# EAGLE design ESPDRONE333 (1) (EAGLE 7.2.0)
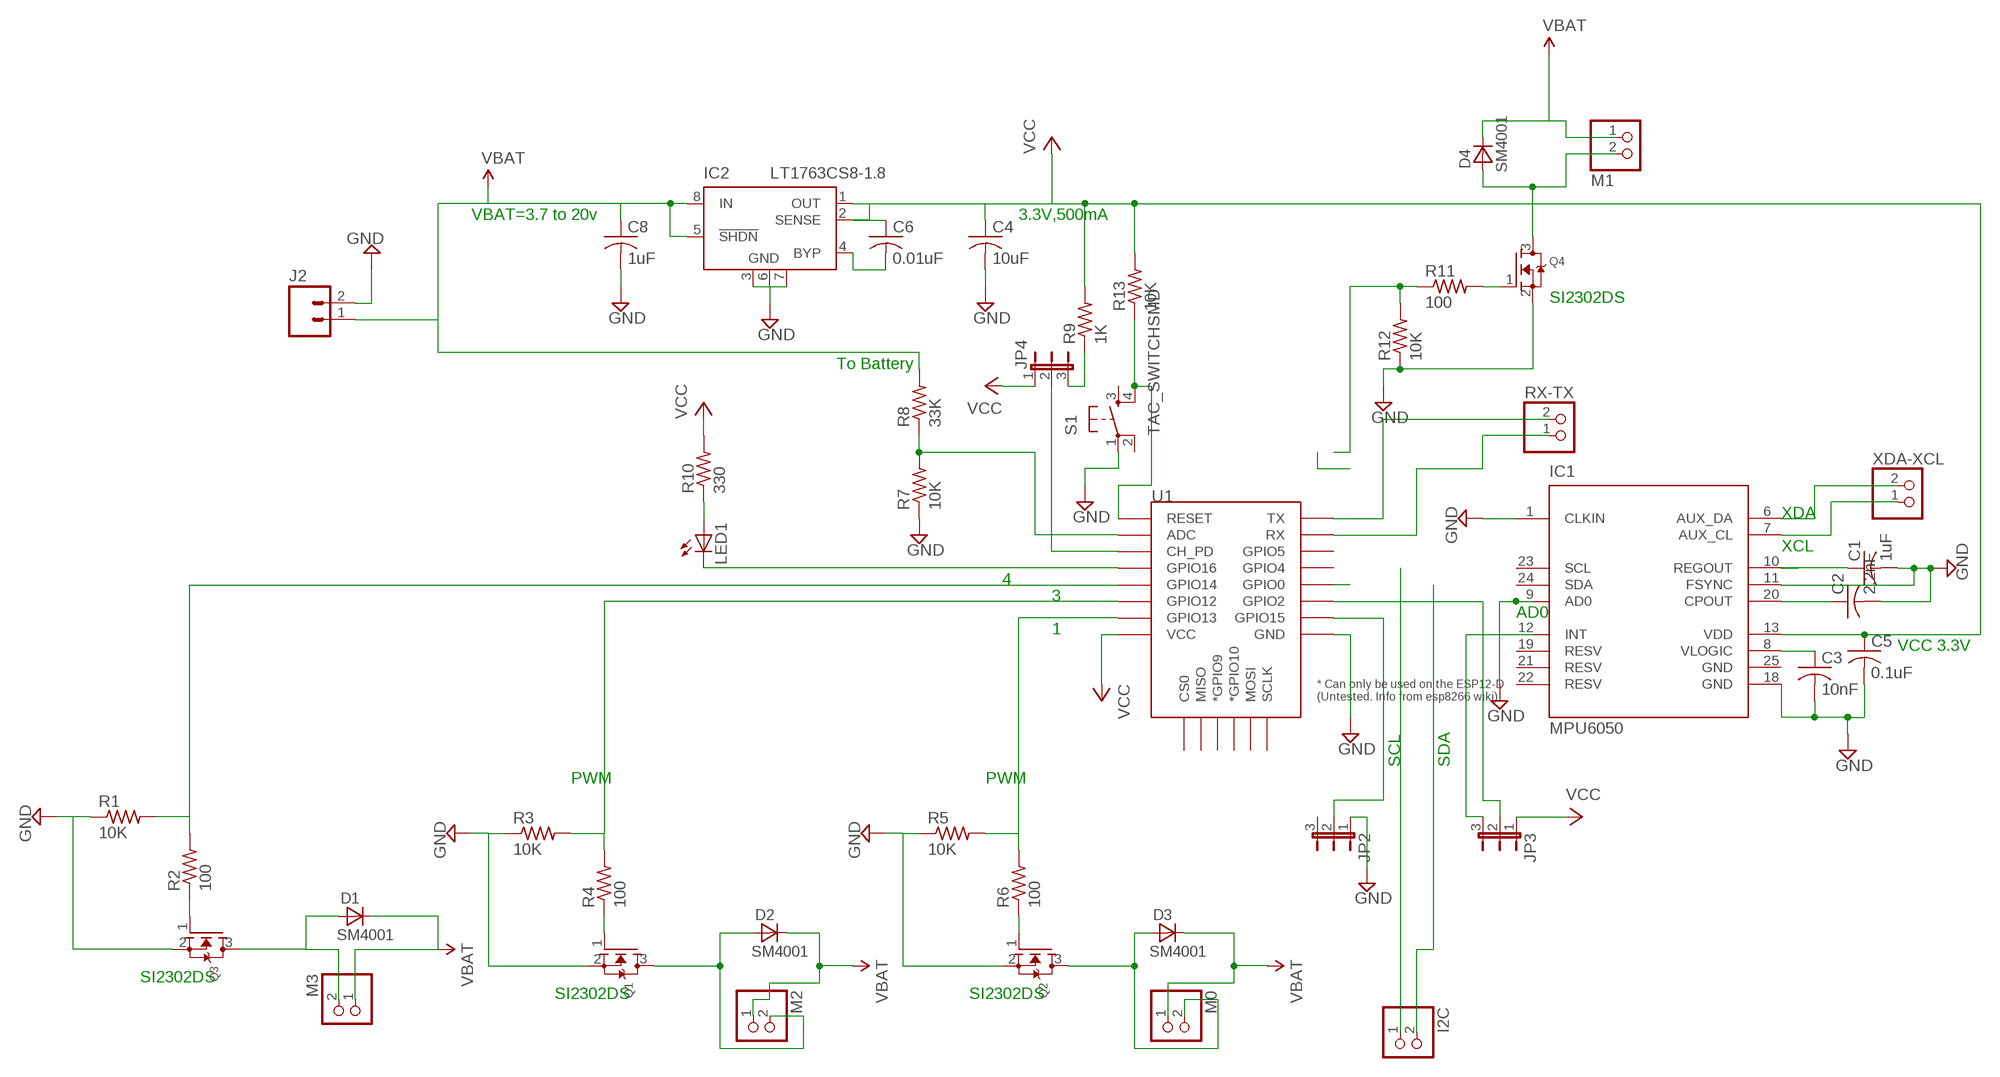
[diagram p0: schematic, sheet 1]

## Parts
C1  1uF  C-USC1206K  [C1206K]
C2  2.2nF  C-USC0603  [C0603]
C3  10nF  C-USC0603  [C0603]
C4  10uF  C-USC1608  [C1608]
C5  0.1uF  C-USC0603  [C0603]
C6  0.01uF  C-USC0603  [C0603]
C8  1uF  C-USC1608  [C1608]
D1  SM4001  SM400GENERIC  [MELF-MLL41]
D2  SM4001  SM400GENERIC  [MELF-MLL41]
D3  SM4001  SM400GENERIC  [MELF-MLL41]
D4  SM4001  SM400GENERIC  [MELF-MLL41]
I2C  JST_2PIN-SMT  [JST-PH-2-SMT]
IC1  MPU6050  [QFN50P400X400X95-25T265X275N]
IC2  LT1763CS8-1.8  [SOIC8]
J2  M02JST-PTH-2  [JST-2-PTH]
JP2  JP2E  [JP2]
JP3  JP2E  [JP2]
JP4  JP2E  [JP2]
LED1  LED  [SMARTLED-TTW]
M0  JST_2PIN-SMT  [JST-PH-2-SMT]
M1  JST_2PIN-SMT  [JST-PH-2-SMT]
M2  JST_2PIN-SMT  [JST-PH-2-SMT]
M3  JST_2PIN-SMT  [JST-PH-2-SMT]
Q1  MOSFET-NREFLOW  [SOT23]
Q2  MOSFET-NREFLOW  [SOT23]
Q3  MOSFET-NREFLOW  [SOT23]
Q4  MOSFET-NREFLOW  [SOT23]
R1  10K  R-US_R0603  [R0603]
R2  100  R-US_R0603  [R0603]
R3  10K  R-US_R0603  [R0603]
R4  100  R-US_R0603  [R0603]
R5  10K  R-US_R0603  [R0603]
R6  100  R-US_R0603  [R0603]
R7  10K  R-US_R0603  [R0603]
R8  33K  R-US_R0603  [R0603]
R9  1K  R-US_R0603  [R0603]
R10  330  R-US_R0603  [R0603]
R11  100  R-US_R0603  [R0603]
R12  10K  R-US_R0603  [R0603]
R13  10K  R-US_R0603  [R0603]
RX-TX  JST_2PIN-SMT  [JST-PH-2-SMT]
S1  TAC_SWITCHSMD  [TACTILE-SWITCH-SMD]
U1  ESP12ESMD  [ESP12E-SMD]
XDA-XCL  JST_2PIN-SMT  [JST-PH-2-SMT]

## Nets
GND: C1.2 C2.2 C3.2 C4.2 C5.2 C8.2 IC1.1(CLKIN) IC1.9(AD0) IC1.11(FSYNC) IC1.18(GND) IC2.3(GND) IC2.7(GND) J2.2 JP2.1 Q1.2(S) Q2.2(S) Q3.2(S) Q4.2(S) R1.1 R3.1 R5.1 R7.1 R12.1 S1.1 U1.GND
I2C: I2C.2
N$1: I2C.1
N$2: R13.1 S1.4 U1.RESET
N$3: R11.1 R12.2
N$4: C1.1 IC1.10(REGOUT)
N$6: IC1.7(AUX_CL) XDA-XCL.1
N$7: C2.1 IC1.20(CPOUT)
N$8: JP3.2 U1.GPIO2
N$9: C3.1 IC1.8(VLOGIC)
N$10: Q3.1(G) R2.1
N$11: D1.A M3.2 Q3.3(D)
N$12: R1.2 R2.2 U1.GPIO14
N$13: R7.2 R8.1 U1.ADC
N$14: Q4.1(G) R11.2
N$15: D2.A M2.2 Q1.3(D)
N$16: R3.2 R4.2 U1.GPIO12
N$17: RX-TX.1 U1.RXD0(RX)
N$18: JP3.3
N$19: Q1.1(G) R4.1
N$20: Q2.1(G) R6.1
N$21: LED1.A@1(A) R10.1
N$22: JP4.3 R9.1
N$23: R5.2 R6.2 U1.GPIO13
N$24: D3.A M0.2 Q2.3(D)
N$25: U1.GPIO0
N$26: JP2.2 U1.GPIO15
N$29: D4.A M1.2 Q4.3(D)
N$31: JP4.2 U1.CH_PD
N$32: LED1.C@1(C) U1.GPIO16
N$35: C6.2 IC2.4(BYP)
VCC: C4.1 C5.1 C6.1 C8.1 D1.C D2.C D3.C D4.C IC1.13(VDD) IC2.1(OUT) IC2.2(SENSE) IC2.5(!SHDN) IC2.8(IN) J2.1 JP3.1 JP4.1 M0.1 M1.1 M2.1 M3.1 R8.2 R9.2 R10.2 R13.2 U1.VCC ; supply symbol labelled VBAT
VCC1: RX-TX.2 U1.TXD0(TX)
VCC2: IC1.6(AUX_DA) XDA-XCL.2
Unconnected: IC1.2(NC) IC1.3(NC) IC1.4(NC) IC1.5(NC) IC1.12(INT) IC1.14(NC) IC1.15(NC) IC1.16(NC) IC1.17(NC) IC1.19(RESV) IC1.21(RESV) IC1.22(RESV) IC1.23(SCL) IC1.24(SDA) JP2.3 S1.2 S1.3 U1.CS0 U1.GPIO4 U1.GPIO5 U1.GPIO9(*GPIO9) U1.GPIO10(*GPIO10) U1.MISO U1.MOSI U1.SCLK

## Notes on the sheet
- VBAT=3.7 to 20v | 3.3V,500mA
- SI2302DS
- To Battery
- XDA
- XCL
- 4
- 3
- AD0
- 1
- VCC 3.3V
- SCL | SDA
- PWM | PWM
- SI2302DS
- SI2302DS | SI2302DS

## Power pins joined to a net without a drawn wire
GND: IC1.25(GND) IC2.6(GND)

## Library data of the parts
C1-C6 C8 = adafruit:C-US: CAPACITOR, American symbol
D1-D4 = _mod_diode:SM400*: SM4001 .. SM4007 General Purpose Rectifier, 1 A SMD-Version of 1N4001 .. 1N4007 Case: MELF-MLL41 = DO 213 AB Author: Dipl.-Ing. FH Rainer Bayer HHN Hochschule Heilbronn, rainer.bayer@hs-heilbronn.de Ingenieurbüro ing-rb, mail@ing-rb.de
I2C M0 M1-M3 RX-TX XDA-XCL = adafruit:JST_2PIN: JST 2-Pin Connectors of various flavors SMT-RA (S2B-PH-SM4) 4UConnector #17311 SMT (B2B-PH-SM4) THM-RA (S2B-PH) THM (B2B-PH)
IC1 = invensense:MPU6050: The triple-axis MEMS gyroscope
IC2 = linear-technology:LT1763CS8: 500mA, Low Noise, LDO Micropower Regulators Source: http://cds.linear.com/docs/Datasheet/1763ff.pdf; MPN: LT1763CS8-1.8; OC_FARNELL: 1273615; OC_NEWARK: 57M6047
J2 = SparkFun-Connectors:M02: Standard 2-pin 0.1" header. Use with - straight break away headers ( PRT-00116) - right angle break away headers (PRT-00553) - swiss pins (PRT-00743) - machine pins (PRT-00117) - female headers (PRT-00115) Molex polarized connector foot print use with: PRT-08233 with associated crimp pins and housings. 2.54_SCREWTERM for use with PRT-10571. 3.5mm Screw Terminal footprints for PRT-08084 5mm Screw Terminal footprints for use with PRT-08432; PROD_ID: CONN-09863; SKU: PRT-09914
JP2-JP4 = jumper:JP2E: JUMPER
LED1 = adafruit:LED: LED OSRAM: - CHIPLED LG R971, LG N971, LY N971, LG Q971, LY Q971, LO R971, LY R971 LH N974, LH R974 LS Q976, LO Q976, LY Q976 LO Q996 - Hyper CHIPLED LW Q18S LB Q993, LB Q99A, LB R99A - SideLED LS A670, LO A670, LY A670, LG A670, LP A670 LB A673, LV A673, LT A673, LW A673 LH A674 LY A675 LS A676, LA A676, LO A676, LY A676, LW A676 LS A679, LY A679, LG A679 - Hyper Micro SIDELED® LS Y876, LA Y876, LO Y876, LY Y876 LT Y87S - SmartLED LW L88C, LW L88S LB L89C, LB L89S, LG L890 LS L89K, LO L89K, LY L89K LS L896, LA L896, LO L896, LY L896 - TOPLED LS T670, LO T670, LY T670, LG T670, LP T670 LSG T670, LSP T670, LSY T670, LOP T670, LYG T670 LG T671, LOG T671, LSG T671 LB T673, LV T673, LT T673, LW T673 LH T674 LS T676, LA T676, LO T676, LY T676, LB T676, LH T676, LSB T676, LW T676 LB T67C, LV T67C, LT T67C, LS T67K, LO T67K, LY T67K, LW E67C LS E67B, LA E67B, LO E67B, LY E67B, LB E67C, LV E67C, LT E67C LW T67C LS T679, LY T679, LG T679 LS T770, LO T770, LY T770, LG T770, LP T770 LB T773, LV T773, LT T773, LW T773 LH T774 LS E675, LA E675, LY E675, LS T675 LS T776, LA T776, LO T776, LY T776, LB T776 LHGB T686 LT T68C, LB T68C - Hyper Mini TOPLED® LB M676 - Mini TOPLED Santana® LG M470 LS M47K, LO M47K, LY M47K Source: http://www.osram.convergy.de/
Q1-Q4 = adafruit:MOSFET-N: N-Channel Mosfet 2N7002E - 60V 260mA SOT23 [Digikey: 2N7002ET1GOSTR-ND] - REEL BSH103 - 30V 850mA SOT23 [Digikey: 568-5013-1-ND]
R1-R13 = adafruit:R-US_: RESISTOR, American symbol
S1 = SparkFun-Retired:TAC_SWITCH: Momentary Switch Button commonly used for reset or general input. Spark Fun Electronics SKU : COM-00097 SMT- SWCH-08247; PROD_ID: SWCH-08247
U1 = esp8266modules:ESP12E: ESP12E Module

## Board
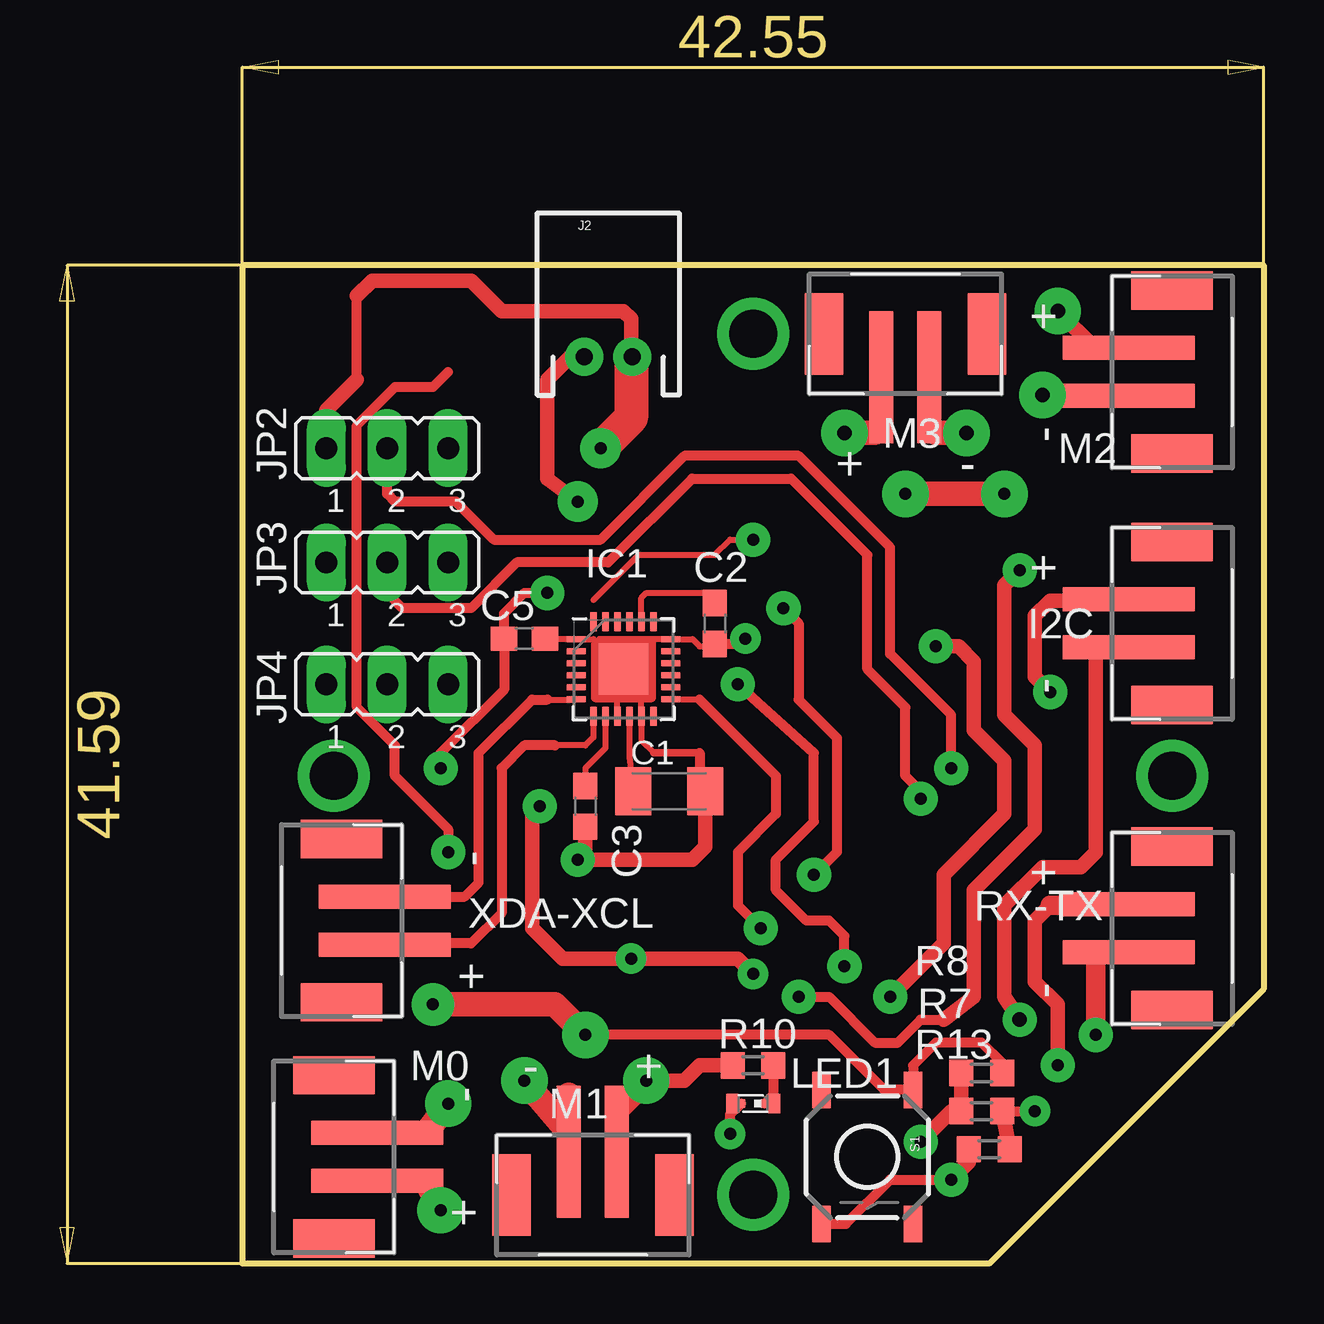
[diagram p1: board, top side]
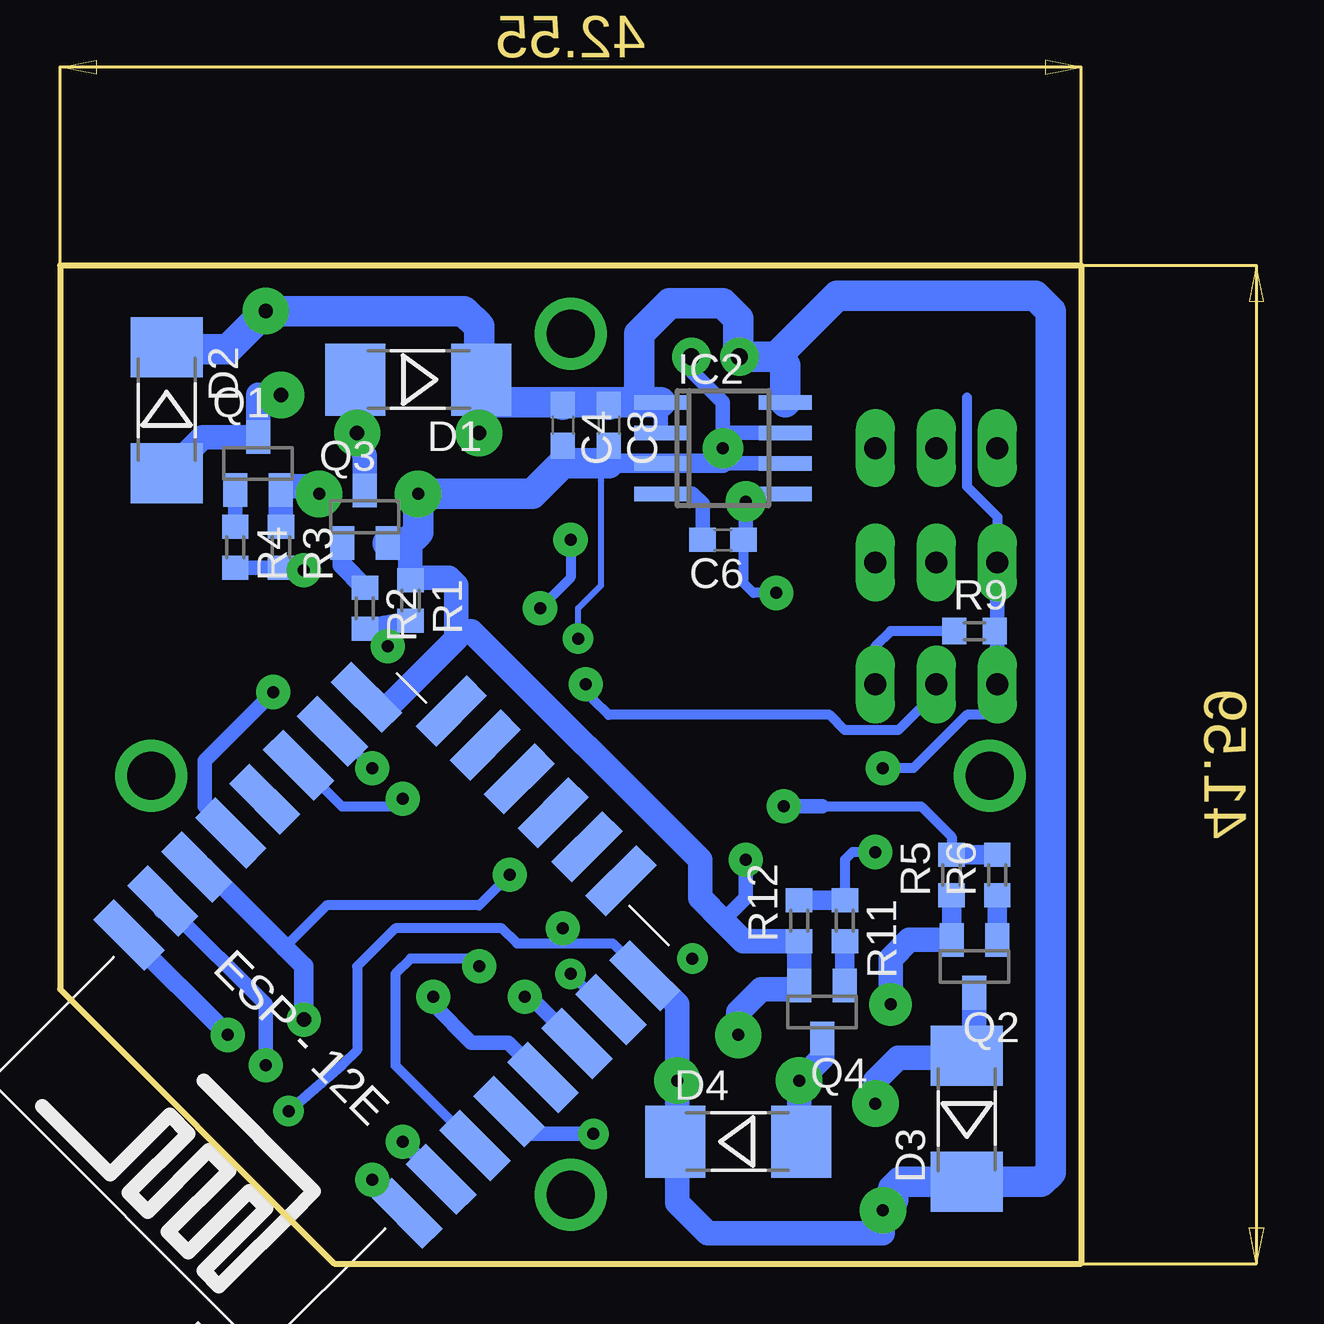
[diagram p2: board, bottom side, seen from below]

Size 42.55 x 41.59 mm. Coordinates in mm from the lower left corner, seen from the top.
Outline: 42.55,41.59 0,41.59 0,0 31.11,0 42.55,11.43 42.55,41.59
Copper layers (1*16): Top 0.035mm / dielectric 1.5mm / Bottom 0.035mm
Design rules "default *": minimum track width 10mil, minimum drill 24mil, track to track 8mil, track to pad 8mil, pad to pad 8mil, via to via 8mil, smd to smd 8mil, copper to edge 40mil, drill to drill 8mil, minimum pad ring 14mil, minimum via ring 14mil, stop-mask expansion 4mil, vias tented up to drill 0mil, thermal gap 10mil

### Footprints (pad centres in the part's own frame; a part is rotated, then mirrored left to right if it is on the bottom)
C1206K = smd 1.5 x 2: 1 -1.5,0; 2 1.5,0
C0603 = smd 1.1 x 1: 1 -0.85,0; 2 0.85,0
C1608 = smd 1.1 x 1: 1 -0.85,0; 2 0.85,0
MELF-MLL41 = smd 2.5 x 3: A 2.625,0; C -2.625,0
JST-PH-2-SMT = smd 1 x 5.5: 1 -1,-1.8; 2 1,-1.8 | smd 1.6 x 3.4: NC1 -3.4,0; NC2 3.4,0
QFN50P400X400X95-25T265X275N = smd 0.26 x 0.79: 1 -1.25,-1.97; 2 -0.75,-1.97; 3 -0.25,-1.97; 4 0.25,-1.97; 5 0.75,-1.97; 6 1.25,-1.97; 13 1.25,1.97; 14 0.75,1.97; 15 0.25,1.97; 16 -0.25,1.97; 17 -0.75,1.97; 18 -1.25,1.97 | smd 0.79 x 0.26: 7 1.97,-1.25; 8 1.97,-0.75; 9 1.97,-0.25; 10 1.97,0.25; 11 1.97,0.75; 12 1.97,1.25; 19 -1.97,1.25; 20 -1.97,0.75; 21 -1.97,0.25; 22 -1.97,-0.25; 23 -1.97,-0.75; 24 -1.97,-1.25 | smd 2.15 x 2.05: 25 0,0
SOIC8 = smd 0.6 x 2.2: 1 -1.905,-2.6; 2 -0.635,-2.6; 3 0.635,-2.6; 4 1.905,-2.6; 5 1.905,2.6; 6 0.635,2.6; 7 -0.635,2.6; 8 -1.905,2.6
JST-2-PTH = drill 0.7 pad 1.6: 1 -1,0; 2 1,0
JP2 = drill 0.914 long: 1 -2.54,0; 2 0,0; 3 2.54,0
SMARTLED-TTW = smd 0.8 x 0.5: A 0,-0.875; C 0,0.875 | smd 0.35 x 0.35: A@1 0,-0.5; C@1 0,0.5
SOT23 = smd 1 x 1.4: 1 -0.95,-1.1; 2 0.95,-1.1; 3 0,1.1
R0603 = smd 1 x 1.1: 1 -0.85,0; 2 0.85,0
TACTILE-SWITCH-SMD = smd 1.524 x 0.762: 1 -2.794,1.905; 2 2.794,1.905; 3 -2.794,-1.905; 4 2.794,-1.905
ESP12E-SMD = smd 3 x 1.2: ADC -8.3,3.8; CH_PD -8.3,1.8; GND 8.1,-8.2; GPIO0 8.1,-2.2; GPIO2 8.1,-4.2; GPIO4 8.1,-0.2; GPIO5 8.1,1.8; GPIO12 -8.3,-4.2; GPIO13 -8.3,-6.2; GPIO14 -8.3,-2.2; GPIO15 8.1,-6.2; GPIO16 -8.3,-0.2; RESET -8.3,5.8; RXD0 8.1,3.8; TXD0 8.1,5.8; VCC -8.3,-8.2 | smd 1.2 x 3: CS0 -4.8,-10.3; GPIO9 -0.8,-10.3; GPIO10 1.2,-10.3; MISO -2.8,-10.3; MOSI 3.2,-10.3; SCLK 5.2,-10.3

### Placement (x,y rotation side)
C1  17.78,19.68 0 top
C2  19.68,26.67 270 top
C3  14.29,19.05 270 top
C4  21.59,34.92 270 bottom
C5  11.75,26.04 0 top
C6  14.92,30.16 180 bottom
C8  19.68,34.92 270 bottom
D1  27.62,36.83 180 bottom
D2  38.1,35.56 270 bottom
D3  4.76,6.03 90 bottom
D4  14.29,5.08 0 bottom
I2C  38.73,26.67 270 top
IC1  15.88,24.77 270 top
IC2  14.92,33.97 270 bottom
J2  15.24,37.78 0 top
JP2  6.03,33.97 0 top
JP3  6.03,29.21 0 top
JP4  6.03,24.13 0 top
LED1  21.27,6.67 90 top
M0  3.81,4.45 90 top
M1  14.61,2.86 180 top
M2  38.73,37.15 270 top
M3  27.62,38.73 0 top
Q1  34.29,33.34 0 bottom
Q2  4.45,12.38 180 bottom
Q3  29.84,31.11 0 bottom
Q4  10.79,10.48 180 bottom
R1  27.94,27.62 270 bottom
R2  29.84,27.3 270 bottom
R3  33.34,29.84 270 bottom
R4  35.24,29.84 270 bottom
R5  5.4,16.19 90 bottom
R6  3.49,16.19 90 bottom
R7  30.8,7.94 180 top
R8  30.8,6.35 0 top
R9  4.45,26.35 0 bottom
R10  21.27,8.26 180 top
R11  9.84,14.29 270 bottom
R12  11.75,14.29 90 bottom
R13  31.11,4.76 0 top
RX-TX  38.73,13.97 270 top
S1  26.04,4.45 270 top
U1  29.84,12.06 135 bottom
XDA-XCL  4.13,14.29 90 top

### Tracks (layer width: path | path; a pad name or v marks a point on that pad's centre or on a via)
GND  (via drill 0.5 pad 1.27, 0.5 pad 1.42, 0.5 pad 1.68, 0.5 pad 1.78, 0.5 pad 1.93)
  Top 0.254: C5.2 12.78,26.02 IC1.1 14.62,26.02 IC1.25 | 17.14,21.27 16.62,21.79 IC1.11 16.62,24.02 IC1.25 | C1.2 19.28,20.09 | IC1.25 17.12,26.02 IC1.18 18.75,26.02 19.05,25.72 19.37,25.72 19.58,26.04 C2.2 | IC1.9 15.62,24.52 IC1.25
  Top 0.305: 17.14,21.27 19.05,21.27 19.05,19.91 C1.2 | C2.2 20.22,25.82
  Top 0.406: R7.1 31.65,8.36 30.8,9.21 28.89,9.21 27.94,8.26 S1.1 26.73,7.24 24.45,9.53 v14.29,9.53 | 4.76,36.83 4.76,40.32 | 19.05,21.27 19.05,20 19.37,19.68 | 20.22,25.82 20.42,25.82 v20.95,26.04
  Top 0.61: JP2.1 3.49,35.56 4.76,36.83 | J2.2 16.19,37.83 16.19,39.37 15.88,39.69 10.79,39.69 9.53,40.96 5.4,40.96 4.76,40.32 | C3.2 14.29,17.14 v13.97,16.83 18.73,16.83 19.28,17.38 C1.2
  Top 1.016: v31.75,32.07 v27.62,32.07 | v7.94,10.79 13.02,10.79 v14.29,9.53
  Top 1.422: 16.19,37.73 16.19,35.24 v14.92,33.97
  Bottom 0.254: v20.95,26.04 20.95,27.3 20,28.26 20,33.34
  Bottom 0.61: IC2.7 14.92,34.61 | 14.92,34.61 v14.92,33.97 14.92,33.34 IC2.6 | 14.92,34.61 14.92,35.88 16.19,37.15 16.19,37.73 J2.2 | C4.2 21.59,33.34 | C8.2 19.68,33.34 | R3.1 Q1.2 | v13.97,16.83 13.97,15.24 14.92,14.29
  Bottom 0.813: R1.1 | 14.92,33.34 IC2.3 19.68,33.34 | R5.1 Q2.2 | 11.99,11.33 11.89,11.43 Q4.2
  Bottom 1.016: R3.1 33.34,32.38 32.07,32.38 v31.75,32.07 | U1.GND 29.62,23.59 29.21,23.18 28.89,23.18 26.04,26.04 26.04,26.35 | 26.04,26.35 26.04,28.26 26.35,28.57 27.84,28.57 R1.1 | R1.1 27.94,29.7 28.26,30.02 | Q2.2 7.15,13.48 7.94,12.7 v7.94,10.79 | Q4.2 R12.1 14.07,13.44 14.92,14.29 15.88,15.24 15.88,16.83 25.4,26.35 26.04,26.35 | 11.89,11.43 13.34,11.43 14.29,10.48 v14.29,9.53
  Bottom 1.27: 19.68,33.34 20,33.34 21.59,33.34 22.86,32.07 v27.62,32.07 27.62,30.48 28.09,30.02 28.26,30.02 Q3.2
I2C  (via drill 0.5 pad 1.42, 0.6 pad 1.42)
  Top 0.254: 14.62,27.64 16.51,29.53 19.68,29.53 20.32,30.16 v21.27,30.16
  Top 0.406: v22.54,27.3 23.18,26.67 23.18,23.5 24.77,21.91 24.77,17.14 v23.81,16.19
  Top 0.61: 36.98,25.72 35.24,25.72 35.56,25.4 35.56,17.14 34.92,16.51 33.34,16.51 31.75,14.92 31.75,11.11 v32.38,10.16 | 37.47,25.72 36.98,25.72 | 36.98,25.72 I2C.2
  Bottom 0.406: v21.27,30.16 21.27,28.57 v22.54,27.3 | v23.81,16.19 25.08,14.92 31.43,14.92 33.18,13.18
  Bottom 0.813: 36.52,16.52 33.18,13.18 32.38,12.38 v32.38,10.16
N$1  (via drill 0.5 pad 1.42)
  Top 0.61: v33.66,23.81 33.02,24.45 33.02,26.99 33.66,27.62 36.89,27.62 I2C.1
  Bottom 0.61: 35.4,17.93 36.51,19.05 36.51,20.95 v33.66,23.81
N$2  (via drill 0.5 pad 1.42)
  Top 0.406: S1.4 25.15,1.65 26.99,3.49 v29.53,3.49
  Top 0.61: R13.1 30.27,4.23 v29.53,3.49
  Bottom 0.61: U1.RESET 28.13,2.1 v29.53,3.49
N$3  (via drill 0.5 pad 1.42)
  Top 0.406: 8.57,37.15 7.94,36.51 6.35,36.51 4.76,34.92 4.76,23.18 6.35,21.59 6.35,20.32 8.57,18.1 v8.57,17.14
  Bottom 0.406: v8.57,17.14 9.53,17.14 9.84,16.83 R11.1
  Bottom 0.813: R11.1 R12.2
N$4
  Top 0.254: IC1.10 16.12,21.11 C1.1
N$6
  Top 0.254: IC1.7 14.62,21.93 14.29,21.59 13.02,21.59
  Top 0.406: 13.02,21.59 11.75,21.59 10.79,20.64 10.79,14.61 9.53,13.34 5.97,13.34 XDA-XCL.1
N$7
  Top 0.254: IC1.20 16.62,27.74 16.83,27.94 19.37,27.94 19.68,27.62 C2.1
N$8  (via drill 0.5 pad 1.42)
  Top 0.406: v28.26,19.37 28.26,19.68 27.62,20.32 27.62,23.18 26.04,24.77 26.04,29.53 22.86,32.7 18.73,32.7 15.24,29.21 11.43,29.21 9.53,27.3 6.67,27.3 6.03,27.94 JP3.2
  Bottom 0.406: U1.GPIO2 32.51,20.76 30.8,19.05 28.57,19.05 v28.26,19.37
N$9
  Top 0.254: IC1.8 15.12,21.48 14.29,20.64 C3.1
N$10
  Bottom 0.813: Q3.1 30.8,29.11 R2.1
N$11  (via drill 0.6 pad 1.93)
  Top 1.016: M3.2 28.62,34.88 28.89,34.61 v30.16,34.61
  Bottom 1.016: Q3.3 29.84,33.66 30.16,34.29 v30.16,34.61 30.16,36.74 D1.A
  Bottom 1.27: 30.48,36.91 D1.A
N$12  (via drill 0.5 pad 1.42)
  Top 0.61: v28.89,25.72 29.84,25.72 30.48,25.08 30.48,22.23 31.75,20.95 31.75,18.73 29.21,16.19 29.21,13.34 v26.99,11.11
  Bottom 0.61: 22.74,7.82 22.42,7.82 U1.GPIO14 23.88,9.21 25.4,9.21 26.99,10.79 v26.99,11.11 | v28.89,25.72 28.89,26.5 28.99,26.6
  Bottom 0.813: R1.2 28.99,26.6 R2.2
N$13  (via drill 0.5 pad 1.42)
  Top 0.61: 28.57,5.08 v28.26,5.08 29.53,6.35 R8.1 R7.2
  Bottom 0.61: U1.ADC 26.69,3.51 v28.26,5.08
N$14
  Bottom 0.813: R11.2 Q4.1
N$15  (via drill 0.6 pad 1.93)
  Top 1.016: M2.2 33.38,36.15 v33.34,36.2
  Bottom 1.016: D2.A 36.6,34.44 Q1.3 34.29,36.2 v33.34,36.2
N$16  (via drill 0.5 pad 1.42)
  Top 0.406: v23.18,11.11 24.45,11.11 26.35,9.21 27.3,9.21 28.26,10.16 29.21,10.16
  Top 0.61: v32.38,28.89 31.75,28.26 31.75,22.86 33.02,21.59 33.02,18.1 30.48,15.56 30.48,11.11 29.21,10.16
  Bottom 0.61: R4.2 R3.2 32.49,29 v32.38,28.89 | 21.23,9.17 U1.GPIO12 22.95,11.11 v23.18,11.11
N$17  (via drill 0.5 pad 1.42)
  Top 0.61: 33.66,14.92 33.02,14.29 33.02,11.75 33.97,10.79 v33.97,8.26
  Top 0.813: 33.66,14.92 36.89,14.92 RX-TX.1
  Bottom 0.61: 37.94,14.77 33.97,10.79 v33.97,8.26
  Bottom 0.813: U1.RXD0 38.26,14.77 37.94,14.77
N$19
  Bottom 0.61: R4.1 Q1.1
N$20
  Bottom 0.813: R6.1 Q2.1
N$21
  Top 0.406: R10.1 22.12,7.02 LED1.A@1
N$22
  Bottom 0.406: R9.1 7.94,26.35 8.57,25.72 JP4.3
N$23  (via drill 0.5 pad 1.27, 0.5 pad 1.42)
  Top 0.61: v21.27,12.06 20.64,12.7 v16.19,12.7 13.34,12.7 12.06,13.97 12.06,18.73 v12.38,19.05
  Bottom 0.406: U1.GPIO13 19.79,10.58 v21.27,12.06 | 5.5,17.14 R5.2 5.4,17.78 6.67,19.05 10.79,19.05
  Bottom 0.61: v12.38,19.05 10.79,19.05
  Bottom 0.813: R6.2 R5.2
N$24  (via drill 0.5 pad 1.93)
  Top 1.016: M0.2 7.67,5.45 v8.57,6.67
  Bottom 1.016: v8.57,6.67 8.57,7.62 7.62,8.57 4.85,8.57 D3.A 4.45,8.97 Q2.3
N$26  (via drill 0.5 pad 1.42)
  Top 0.406: v29.53,20.64 29.53,22.86 26.99,25.4 26.99,29.84 23.18,33.66 18.41,33.66 14.92,30.16 10.48,30.16 8.89,31.75 6.35,31.75 6.03,32.07 JP2.2
  Bottom 0.406: U1.GPIO15 31.07,22.18 v29.53,20.64
N$29  (via drill 0.5 pad 1.93)
  Top 1.016: 13.61,5.45 13.61,7.03 | M1.2 13.61,5.45 | 13.61,5.45 v11.75,7.62
  Bottom 1.016: D4.A 11.75,5.17 v11.75,7.62 10.79,8.57 Q4.3
N$31  (via drill 0.5 pad 1.42)
  Top 0.406: v20.64,24.13 23.81,21.27 23.81,18.41 22.23,16.83 22.23,15.56 23.5,14.29 24.45,14.29 25.08,13.65 v25.08,12.38
  Bottom 0.406: U1.CH_PD 25.56,4.92 25.56,5.24 28.57,8.26 28.57,12.06 27.94,12.7 25.4,12.7 v25.08,12.38 | JP4.2 6.03,23.81 7.62,22.23 9.84,22.23 10.48,22.86 19.68,22.86 20.32,23.5 v20.64,24.13
N$32  (via drill 0.5 pad 1.27)
  Top 0.406: v20.32,5.4 20.32,6.21 LED1.C@1
  Bottom 0.61: U1.GPIO16 23.8,6.34 22.86,5.4 v20.32,5.4
N$33  (via drill 2)
  other vias: 21.27,2.86
N$34  (via drill 2)
  other vias: 3.81,20.32
N$35
  Bottom 0.61: C6.2 15.77,31.65 16.19,32.07 IC2.4
N$36  (via drill 2)
  other vias: 21.27,38.73
N$37  (via drill 2)
  other vias: 38.73,20.32
VCC  (via drill 0.5 pad 1.27, 0.5 pad 1.42, 0.5 pad 1.68, 0.5 pad 1.93, 0.6 pad 1.93)
  Top 0.254: IC1.13 19.03,23.52 19.05,23.5
  Top 0.406: R8.2 v33.02,6.35 | v12.7,27.94 11.75,27.94 10.9,27.09 C5.1 10.9,23.91 8.26,21.27 v8.26,20.64 | 19.05,23.5 22.23,20.32 22.23,18.73 20.64,17.14 20.64,14.92 v21.59,13.97
  Top 0.61: 14.29,37.73 J2.1 13.65,37.78 12.7,36.83 12.7,32.7 v13.97,31.75 | M2.1 35.51,38.15 v33.97,39.69 | R13.2 R8.2 | v16.83,7.62 18.41,7.62 19.05,8.26 R10.2
  Top 1.016: M3.1 26.62,34.88 26.35,34.61 v25.08,34.61 | M1.1 15.61,6.4 v16.83,7.62 | M0.1 7.67,3.44 v8.26,2.22
  Bottom 0.406: 4.76,36.09 4.76,32.38 3.49,31.11 JP3.1 | R9.2 3.49,26.25 JP4.1 3.49,23.18 3.81,22.86 4.76,22.86 6.99,20.64 v8.26,20.64 | v33.02,6.35 30.8,8.26 30.16,8.89 30.16,12.38 28.57,13.97 24.13,13.97 23.5,13.34 21.27,13.34 | 21.27,13.34 19.52,13.34 U1.VCC | v12.7,27.94 13.65,27.94 14.07,28.36 C6.1 | v21.59,13.97 21.27,13.34
  Bottom 0.61: C6.1 13.97,30.27 v13.97,31.75 13.97,32.07 IC2.5 | 19.58,35.88 C8.1 | IC2.2 IC2.1 | JP4.1 JP3.1
  Bottom 1.016: v25.08,34.61 25.08,35.88 | U1.VCC 18.03,11.99 16.83,10.79 v16.83,7.62 16.83,4.21 | 16.83,4.21 D4.C | 16.83,4.21 16.83,2.54 15.56,1.27 8.26,1.27 v8.26,2.22
  Bottom 1.27: IC2.8 12.32,37.41 12.7,37.78 | 12.7,37.78 J2.1 14.29,37.83 14.29,39.37 14.92,40.01 17.14,40.01 18.41,38.73 18.41,35.88 | IC2.1 18.41,35.88 | 25.08,37.38 25.08,35.88 21.59,35.88 | 25.08,37.38 D1.C | 18.41,35.88 19.68,35.88 | 19.68,35.88 21.59,35.88 | C8.1 19.68,35.88 | C4.1 21.59,35.88 | 25.08,37.38 25.08,39.05 25.72,39.69 v33.97,39.69 35.56,38.1 37.7,38.1 D2.C | 12.7,37.78 10.16,40.32 1.91,40.32 1.27,39.69 1.27,3.81 1.67,3.41 D3.C 7.54,3.41 7.82,3.12 7.82,2.65 v8.26,2.22
VCC1  (via drill 0.5 pad 1.42)
  Top 0.813: v35.56,9.53 35.56,12.7 35.88,13.02 36.89,13.02 RX-TX.2
  Bottom 0.813: U1.TXD0 39.67,13.64 v35.56,9.53
VCC2
  Top 0.254: 12.7,23.5 13.88,23.5 IC1.6
  Top 0.406: XDA-XCL.2 9.26,15.29 9.84,15.88 9.84,21.27 12.06,23.5 12.7,23.5